# EAGLE schematic PCB-TCH-MENU2 (EAGLE 6.4)
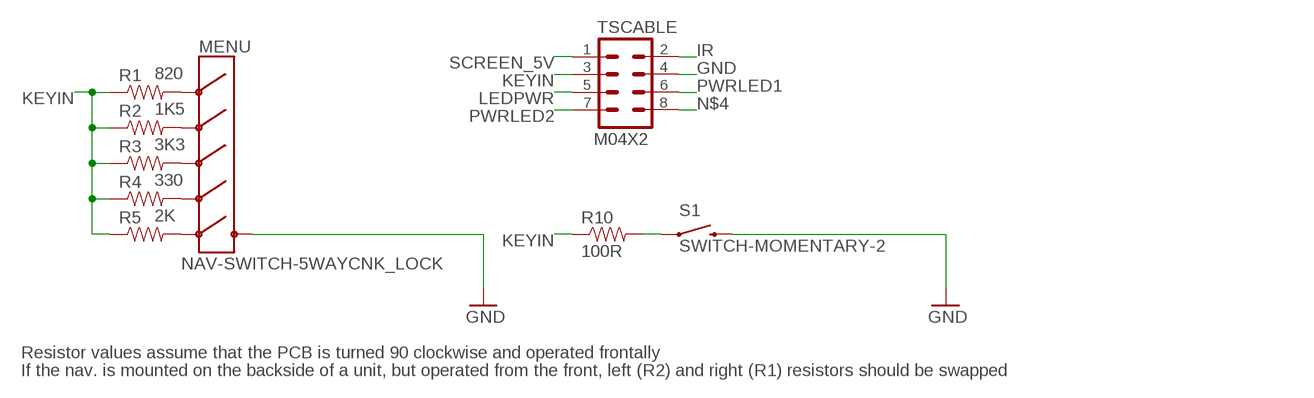
[diagram p0: schematic, sheet 1]

## Parts
MENU  NAV-SWITCH-5WAYCNK_LOCK  [NAV-SWITCH-5WAY]
R1  820  RESISTOR0603-RES  [0603-RES]
R2  1K5  RESISTOR0603-RES  [0603-RES]
R3  3K3  RESISTOR0603-RES  [0603-RES]
R4  330  RESISTOR0603-RES  [0603-RES]
R5  2K  RESISTOR0603-RES  [0603-RES]
R10  100R  RESISTOR0603-RES  [0603-RES]
S1  SWITCH-MOMENTARY-2  [TACTILE_SWITCH_TALL]
TSCABLE  M04X2  [2X4]

## Nets
GND [Power]: MENU.PIN4(COMMON) S1.B2 TSCABLE.4
IR: TSCABLE.2
KEYIN: R1.1 R2.1 R3.1 R4.1 R5.1 R10.1 TSCABLE.3
LEDPWR: TSCABLE.5
N$1: R10.2 S1.A2
N$2: MENU.PIN1(UP) R1.2
N$3: MENU.PIN3(DWN) R2.2
N$4: TSCABLE.8
N$5: MENU.PIN2(LEFT) R3.2
N$6: MENU.PIN5(RIGHT) R4.2
N$9: MENU.PIN6(PUSH) R5.2
PWRLED1: TSCABLE.6
PWRLED2: TSCABLE.7
SCREEN_5V [Power]: TSCABLE.1

## Notes on the sheet
- Resistor values assume that the PCB is turned 90 clockwise and operated frontally
- If the nav. is mounted on the backside of a unit, but operated from the front, left (R2) and right (R1) resistors should be swapped

## Library data of the parts
MENU = SKAARHOJ:NAV-SWITCH-5WAY: For use with a push-button switch made by CnK components. The Part # is
R1-R5 R10 = SparkFun:RESISTOR: Resistor Basic schematic elements and footprints for 0603, 1206, and PTH resistors.
S1 = SparkFun:SWITCH-MOMENTARY-2
TSCABLE = SparkFun:M04X2

## Net classes
0 default: width 0.203 mm, drill 0.61 mm, clearance 0.203 mm
1 Power: width 0.406 mm, drill 0.61 mm, clearance 0.305 mm